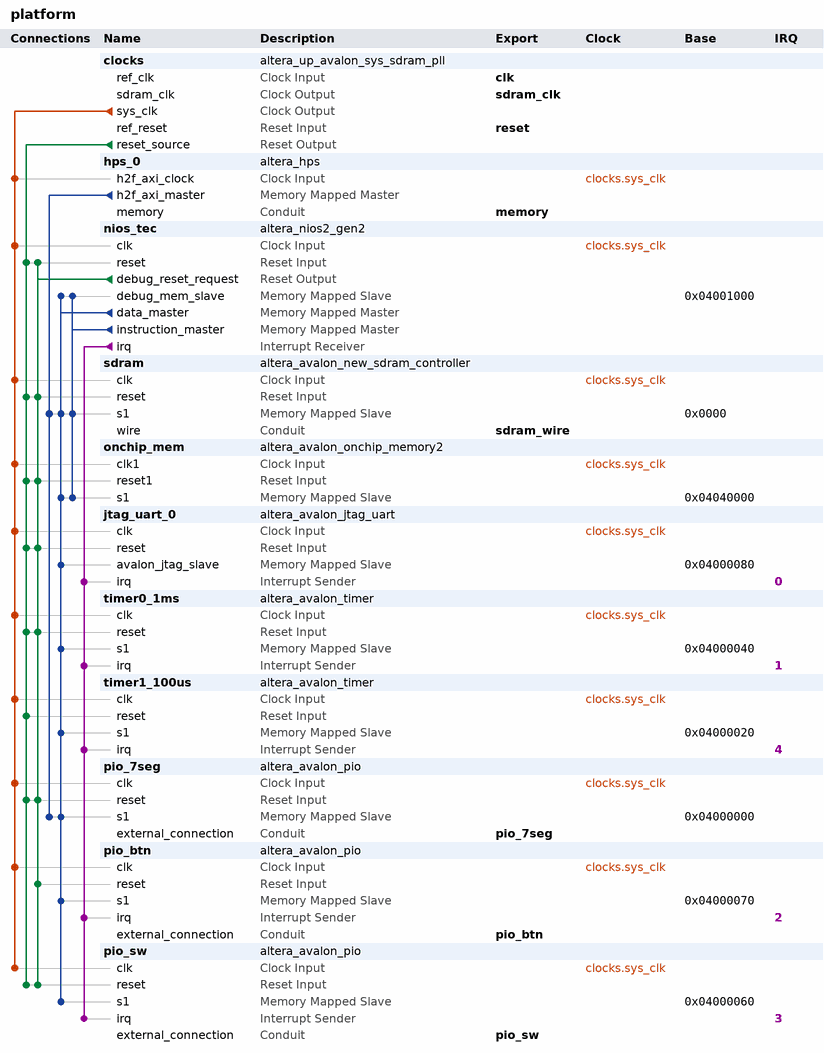
[diagram p0: system contents]
# Platform Designer (Qsys) system platform, Cyclone V 5CSEMA5F31C6
# Parameters at their usual value, and those the tool derives, are not listed.
package require -exact qsys 20.1
create_system platform
set_project_property DEVICE_FAMILY {Cyclone V}
set_project_property DEVICE 5CSEMA5F31C6

add_instance clocks altera_up_avalon_sys_sdram_pll 18.0
set_instance_parameter_value clocks CV_boards DE1-SoC
set_instance_parameter_value clocks gui_outclk 100.0
set_instance_parameter_value clocks gui_refclk 50.0

add_instance hps_0 altera_hps 20.1
set_instance_parameter_value hps_0 EMAC1_Mode N/A
set_instance_parameter_value hps_0 EMAC1_PinMuxing Unused
set_instance_parameter_value hps_0 F2SCLK_COLDRST_Enable false
set_instance_parameter_value hps_0 F2SCLK_DBGRST_Enable false
set_instance_parameter_value hps_0 F2SCLK_WARMRST_Enable false
set_instance_parameter_value hps_0 F2SINTERRUPT_Enable false
set_instance_parameter_value hps_0 F2S_Width 0
set_instance_parameter_value hps_0 FPGA_PERIPHERAL_OUTPUT_CLOCK_FREQ_EMAC0_GTX_CLK 125
set_instance_parameter_value hps_0 FPGA_PERIPHERAL_OUTPUT_CLOCK_FREQ_EMAC0_MD_CLK 2.5
set_instance_parameter_value hps_0 FPGA_PERIPHERAL_OUTPUT_CLOCK_FREQ_EMAC1_GTX_CLK 125
set_instance_parameter_value hps_0 FPGA_PERIPHERAL_OUTPUT_CLOCK_FREQ_EMAC1_MD_CLK 2.5
set_instance_parameter_value hps_0 HPS_PROTOCOL DDR3
set_instance_parameter_value hps_0 I2C0_Mode N/A
set_instance_parameter_value hps_0 I2C0_PinMuxing Unused
set_instance_parameter_value hps_0 I2C1_Mode N/A
set_instance_parameter_value hps_0 I2C1_PinMuxing Unused
set_instance_parameter_value hps_0 LWH2F_Enable false
set_instance_parameter_value hps_0 MEM_BANKADDR_WIDTH 3
set_instance_parameter_value hps_0 MEM_CLK_FREQ 300.0
set_instance_parameter_value hps_0 MEM_CLK_FREQ_MAX 400.0
set_instance_parameter_value hps_0 MEM_COL_ADDR_WIDTH 8
set_instance_parameter_value hps_0 MEM_DQ_WIDTH 8
set_instance_parameter_value hps_0 MEM_DRV_STR RZQ/6
set_instance_parameter_value hps_0 MEM_ROW_ADDR_WIDTH 12
set_instance_parameter_value hps_0 MEM_RTT_NOM {ODT Disabled}
set_instance_parameter_value hps_0 MEM_RTT_WR {Dynamic ODT off}
set_instance_parameter_value hps_0 MEM_TCL 7
set_instance_parameter_value hps_0 MEM_TFAW_NS 37.5
set_instance_parameter_value hps_0 MEM_TINIT_US 499
set_instance_parameter_value hps_0 MEM_TMRD_CK 3
set_instance_parameter_value hps_0 MEM_TRAS_NS 40.0
set_instance_parameter_value hps_0 MEM_TRCD_NS 15.0
set_instance_parameter_value hps_0 MEM_TREFI_US 7.0
set_instance_parameter_value hps_0 MEM_TRFC_NS 75.0
set_instance_parameter_value hps_0 MEM_TRP_NS 15.0
set_instance_parameter_value hps_0 MEM_TWTR 2
set_instance_parameter_value hps_0 MEM_VENDOR JEDEC
set_instance_parameter_value hps_0 MEM_WTCL 6
set_instance_parameter_value hps_0 QSPI_Mode N/A
set_instance_parameter_value hps_0 QSPI_PinMuxing Unused
set_instance_parameter_value hps_0 REF_CLK_FREQ 125.0
set_instance_parameter_value hps_0 S2FCLK_USER2CLK 5
set_instance_parameter_value hps_0 S2F_Width 1
set_instance_parameter_value hps_0 SDIO_Mode N/A
set_instance_parameter_value hps_0 SDIO_PinMuxing Unused
set_instance_parameter_value hps_0 SPIM1_Mode N/A
set_instance_parameter_value hps_0 SPIM1_PinMuxing Unused
set_instance_parameter_value hps_0 STM_Enable false
set_instance_parameter_value hps_0 TIMING_BOARD_AC_SKEW 0.02
set_instance_parameter_value hps_0 TIMING_BOARD_AC_TO_CK_SKEW 0.0
set_instance_parameter_value hps_0 TIMING_BOARD_DQ_TO_DQS_SKEW 0.0
set_instance_parameter_value hps_0 TIMING_BOARD_MAX_CK_DELAY 0.6
set_instance_parameter_value hps_0 TIMING_BOARD_MAX_DQS_DELAY 0.6
set_instance_parameter_value hps_0 TIMING_BOARD_SKEW_BETWEEN_DQS 0.02
set_instance_parameter_value hps_0 TIMING_BOARD_SKEW_CKDQS_DIMM_MAX 0.01
set_instance_parameter_value hps_0 TIMING_BOARD_SKEW_CKDQS_DIMM_MIN -0.01
set_instance_parameter_value hps_0 TIMING_BOARD_SKEW_WITHIN_DQS 0.02
set_instance_parameter_value hps_0 TIMING_TDH 125
set_instance_parameter_value hps_0 TIMING_TDQSCK 400
set_instance_parameter_value hps_0 TIMING_TDQSQ 120
set_instance_parameter_value hps_0 TIMING_TDS 50
set_instance_parameter_value hps_0 TIMING_TIH 250
set_instance_parameter_value hps_0 TIMING_TIS 175
set_instance_parameter_value hps_0 TIMING_TQSH 0.38
set_instance_parameter_value hps_0 UART0_Mode N/A
set_instance_parameter_value hps_0 UART0_PinMuxing Unused
set_instance_parameter_value hps_0 USB1_Mode N/A
set_instance_parameter_value hps_0 USB1_PinMuxing Unused
set_instance_parameter_value hps_0 desired_cfg_clk_mhz 100.0
set_instance_parameter_value hps_0 desired_qspi_clk_mhz 400.0

add_instance nios_tec altera_nios2_gen2 20.1
set_instance_parameter_value nios_tec dcache_size 2048
set_instance_parameter_value nios_tec exceptionSlave onchip_mem.s1
set_instance_parameter_value nios_tec icache_size 4096
set_instance_parameter_value nios_tec impl Tiny
set_instance_parameter_value nios_tec resetSlave onchip_mem.s1

add_instance sdram altera_avalon_new_sdram_controller 20.1
set_instance_parameter_value sdram TAC 5.4
set_instance_parameter_value sdram TRCD 15.0
set_instance_parameter_value sdram TRP 15.0
set_instance_parameter_value sdram casLatency 3
set_instance_parameter_value sdram columnWidth 10
set_instance_parameter_value sdram dataWidth 16
set_instance_parameter_value sdram generateSimulationModel false
set_instance_parameter_value sdram model single_Micron_MT48LC4M32B2_7_chip
set_instance_parameter_value sdram numberOfBanks 4
set_instance_parameter_value sdram numberOfChipSelects 1
set_instance_parameter_value sdram powerUpDelay 100.0
set_instance_parameter_value sdram refreshPeriod 7.8125
set_instance_parameter_value sdram rowWidth 13

add_instance onchip_mem altera_avalon_onchip_memory2 20.1
set_instance_parameter_value onchip_mem dataWidth 32
set_instance_parameter_value onchip_mem dualPort false
set_instance_parameter_value onchip_mem initMemContent true
set_instance_parameter_value onchip_mem initializationFileName onchip_mem.hex
set_instance_parameter_value onchip_mem memorySize 131072

add_instance jtag_uart_0 altera_avalon_jtag_uart 20.1
set_instance_parameter_value jtag_uart_0 simInteractiveOptions NO_INTERACTIVE_WINDOWS

add_instance timer0_1ms altera_avalon_timer 20.1
set_instance_parameter_value timer0_1ms fixedPeriod true
set_instance_parameter_value timer0_1ms period 1
set_instance_parameter_value timer0_1ms periodUnits MSEC
set_instance_parameter_value timer0_1ms snapshot false

add_instance timer1_100us altera_avalon_timer 20.1
set_instance_parameter_value timer1_100us fixedPeriod true
set_instance_parameter_value timer1_100us period 100
set_instance_parameter_value timer1_100us periodUnits USEC
set_instance_parameter_value timer1_100us snapshot false

add_instance pio_7seg altera_avalon_pio 20.1
set_instance_parameter_value pio_7seg bitModifyingOutReg true
set_instance_parameter_value pio_7seg direction Output
set_instance_parameter_value pio_7seg width 24

add_instance pio_btn altera_avalon_pio 20.1
set_instance_parameter_value pio_btn captureEdge true
set_instance_parameter_value pio_btn direction Input
set_instance_parameter_value pio_btn edgeType FALLING
set_instance_parameter_value pio_btn generateIRQ true
set_instance_parameter_value pio_btn irqType EDGE
set_instance_parameter_value pio_btn simDoTestBenchWiring true
set_instance_parameter_value pio_btn width 4

add_instance pio_sw altera_avalon_pio 20.1
set_instance_parameter_value pio_sw captureEdge true
set_instance_parameter_value pio_sw direction Input
set_instance_parameter_value pio_sw edgeType FALLING
set_instance_parameter_value pio_sw generateIRQ true
set_instance_parameter_value pio_sw irqType EDGE
set_instance_parameter_value pio_sw simDoTestBenchWiring true
set_instance_parameter_value pio_sw width 10

# connections
add_connection clocks.sys_clk hps_0.h2f_axi_clock clock
add_connection clocks.sys_clk jtag_uart_0.clk clock
add_connection clocks.sys_clk nios_tec.clk clock
add_connection clocks.sys_clk onchip_mem.clk1 clock
add_connection clocks.sys_clk pio_7seg.clk clock
add_connection clocks.sys_clk pio_btn.clk clock
add_connection clocks.sys_clk pio_sw.clk clock
add_connection clocks.sys_clk sdram.clk clock
add_connection clocks.sys_clk timer0_1ms.clk clock
add_connection clocks.sys_clk timer1_100us.clk clock
add_connection clocks.reset_source jtag_uart_0.reset reset
add_connection clocks.reset_source nios_tec.reset reset
add_connection clocks.reset_source onchip_mem.reset1 reset
add_connection clocks.reset_source pio_7seg.reset reset
add_connection clocks.reset_source pio_sw.reset reset
add_connection clocks.reset_source sdram.reset reset
add_connection clocks.reset_source timer0_1ms.reset reset
add_connection clocks.reset_source timer1_100us.reset reset
add_connection nios_tec.debug_reset_request jtag_uart_0.reset reset
add_connection nios_tec.debug_reset_request nios_tec.reset reset
add_connection nios_tec.debug_reset_request onchip_mem.reset1 reset
add_connection nios_tec.debug_reset_request pio_7seg.reset reset
add_connection nios_tec.debug_reset_request pio_btn.reset reset
add_connection nios_tec.debug_reset_request pio_sw.reset reset
add_connection nios_tec.debug_reset_request sdram.reset reset
add_connection nios_tec.debug_reset_request timer0_1ms.reset reset
add_connection hps_0.h2f_axi_master pio_7seg.s1 avalon
set_connection_parameter_value hps_0.h2f_axi_master/pio_7seg.s1 baseAddress 0x04000000
add_connection hps_0.h2f_axi_master sdram.s1 avalon
set_connection_parameter_value hps_0.h2f_axi_master/sdram.s1 baseAddress 0x0000
add_connection nios_tec.data_master jtag_uart_0.avalon_jtag_slave avalon
set_connection_parameter_value nios_tec.data_master/jtag_uart_0.avalon_jtag_slave baseAddress 0x04000080
add_connection nios_tec.data_master nios_tec.debug_mem_slave avalon
set_connection_parameter_value nios_tec.data_master/nios_tec.debug_mem_slave baseAddress 0x04001000
add_connection nios_tec.data_master onchip_mem.s1 avalon
set_connection_parameter_value nios_tec.data_master/onchip_mem.s1 baseAddress 0x04040000
add_connection nios_tec.data_master pio_7seg.s1 avalon
set_connection_parameter_value nios_tec.data_master/pio_7seg.s1 baseAddress 0x04000000
add_connection nios_tec.data_master pio_btn.s1 avalon
set_connection_parameter_value nios_tec.data_master/pio_btn.s1 baseAddress 0x04000070
add_connection nios_tec.data_master pio_sw.s1 avalon
set_connection_parameter_value nios_tec.data_master/pio_sw.s1 baseAddress 0x04000060
add_connection nios_tec.data_master sdram.s1 avalon
set_connection_parameter_value nios_tec.data_master/sdram.s1 baseAddress 0x0000
add_connection nios_tec.data_master timer0_1ms.s1 avalon
set_connection_parameter_value nios_tec.data_master/timer0_1ms.s1 baseAddress 0x04000040
add_connection nios_tec.data_master timer1_100us.s1 avalon
set_connection_parameter_value nios_tec.data_master/timer1_100us.s1 baseAddress 0x04000020
add_connection nios_tec.instruction_master nios_tec.debug_mem_slave avalon
set_connection_parameter_value nios_tec.instruction_master/nios_tec.debug_mem_slave baseAddress 0x04001000
add_connection nios_tec.instruction_master onchip_mem.s1 avalon
set_connection_parameter_value nios_tec.instruction_master/onchip_mem.s1 baseAddress 0x04040000
add_connection nios_tec.instruction_master sdram.s1 avalon
set_connection_parameter_value nios_tec.instruction_master/sdram.s1 baseAddress 0x0000
add_connection nios_tec.irq jtag_uart_0.irq interrupt
set_connection_parameter_value nios_tec.irq/jtag_uart_0.irq irqNumber 0
add_connection nios_tec.irq pio_btn.irq interrupt
set_connection_parameter_value nios_tec.irq/pio_btn.irq irqNumber 2
add_connection nios_tec.irq pio_sw.irq interrupt
set_connection_parameter_value nios_tec.irq/pio_sw.irq irqNumber 3
add_connection nios_tec.irq timer0_1ms.irq interrupt
set_connection_parameter_value nios_tec.irq/timer0_1ms.irq irqNumber 1
add_connection nios_tec.irq timer1_100us.irq interrupt
set_connection_parameter_value nios_tec.irq/timer1_100us.irq irqNumber 4

# exported interfaces
add_interface clk clock sink
set_interface_property clk EXPORT_OF clocks.ref_clk
add_interface memory conduit end
set_interface_property memory EXPORT_OF hps_0.memory
add_interface pio_7seg conduit end
set_interface_property pio_7seg EXPORT_OF pio_7seg.external_connection
add_interface pio_btn conduit end
set_interface_property pio_btn EXPORT_OF pio_btn.external_connection
add_interface pio_sw conduit end
set_interface_property pio_sw EXPORT_OF pio_sw.external_connection
add_interface reset reset sink
set_interface_property reset EXPORT_OF clocks.ref_reset
add_interface sdram_clk clock source
set_interface_property sdram_clk EXPORT_OF clocks.sdram_clk
add_interface sdram_wire conduit end
set_interface_property sdram_wire EXPORT_OF sdram.wire

set_interconnect_requirement {$system} qsys_mm.clockCrossingAdapter HANDSHAKE
set_interconnect_requirement {$system} qsys_mm.enableEccProtection FALSE
set_interconnect_requirement {$system} qsys_mm.insertDefaultSlave FALSE
set_interconnect_requirement {$system} qsys_mm.maxAdditionalLatency 1

save_system platform.qsys
